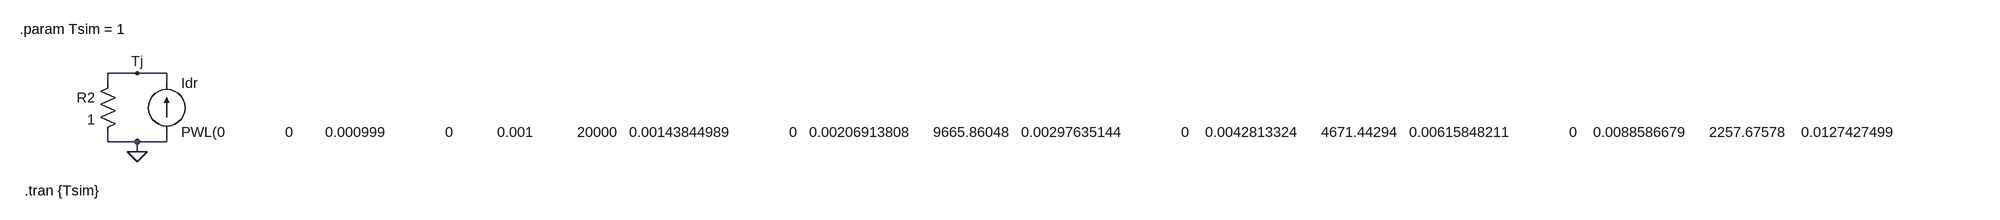
[diagram p0: schematic thermal_test_file2.asc]
thermal_test_file2.asc, the LTspice schematic file:
Version 4
SHEET 1 3692 900
WIRE 0 -192 -48 -192
WIRE 48 -192 0 -192
WIRE -48 -176 -48 -192
WIRE 48 -176 48 -192
WIRE -48 -80 -48 -96
WIRE 0 -80 -48 -80
WIRE 48 -80 48 -96
WIRE 48 -80 0 -80
WIRE 0 -64 0 -80
FLAG 0 -64 0
FLAG 0 -192 Tj
SYMBOL res -32 -192 M0
SYMATTR InstName R2
SYMATTR Value 1
SYMBOL current 48 -96 M180
WINDOW 0 24 80 Left 2
WINDOW 3 24 0 Left 2
WINDOW 123 0 0 Left 0
WINDOW 39 0 0 Left 0
SYMATTR InstName Idr
SYMATTR Value              PWL(0               0        0.000999               0           0.001           20000   0.00143844989               0   0.00206913808      9665.86048   0.00297635144               0    0.0042813324      4671.44294   0.00615848211               0    0.0088586679      2257.67578    0.0127427499               0    0.0183298071      1091.11896     0.026366509               0    0.0379269019       527.33018    0.0545559478               0     0.078475997      254.854997     0.112883789               0     0.162377674      123.169642     0.233572147               0     0.335981829      59.5270288     0.483293024               0     0.695192796      28.7689978               1               0)
TEXT -192 -264 Left 2 !.param Tsim = 1
TEXT -184 0 Left 2 !.tran {Tsim}

The netlist it stands for:
* thermal_test_file2.asc
R2 Tj 0 1
Idr 0 Tj PWL(0               0        0.000999               0           0.001           20000   0.00143844989               0   0.00206913808      9665.86048   0.00297635144               0    0.0042813324      4671.44294   0.00615848211               0    0.0088586679      2257.67578    0.0127427499               0    0.0183298071      1091.11896     0.026366509               0    0.0379269019       527.33018    0.0545559478               0     0.078475997      254.854997     0.112883789               0     0.162377674      123.169642     0.233572147               0     0.335981829      59.5270288     0.483293024               0     0.695192796      28.7689978               1               0)
.param Tsim = 1
.tran {Tsim}
.backanno
.end